# Altium project RS2-708_V010.PrjPCB (part 4 of 6)
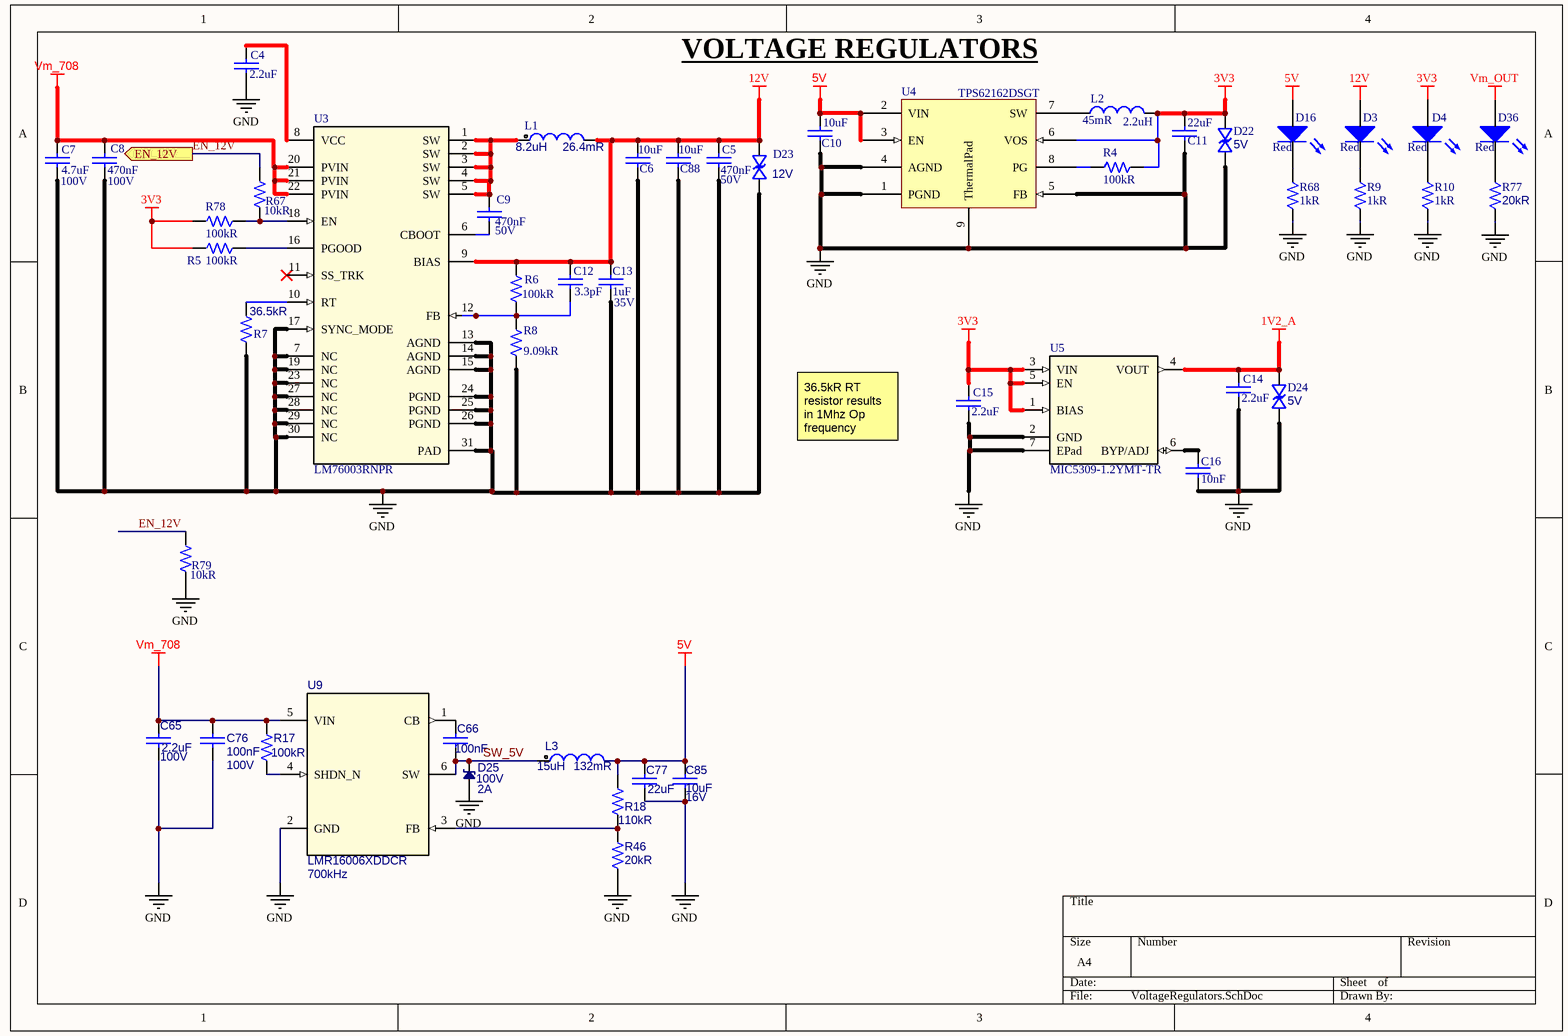
[diagram p10: VoltageRegulators.SchDoc]

## Sheet VoltageRegulators.SchDoc (continued)
### Library data of the parts
C4 C14 C15 = Capacitor: Manufacturer 1: Murata; Manufacturer Part Number 1: GRM155R61A225KE95D; Material: Ceramic; Dielectric: X5R; Voltage Rating (DC): 10V; Manufacturer: *; Manufacturer Part Number: *; Supplier: *; Supplier Part Number: *; Tolerance: *; Voltage: *; Footprint: *; Temperature Coefficient: *; Supplier 1: Digi-Key; Supplier Part Number 1: 490-10451-1-ND; Stock 1: 815357; Pricing 1: 1=0,11000, 10=0,08100, 100=0,03800, 500=0,02664, 1000=0,02205, 2500=0,02052, 5000=0,01878 (USD); RoHS: Yes; Mount: Surface Mount; Case/Package: 0402; Weight: 0.000212oz; Case Code (Metric): 1005; Case Code (Imperial): 0402; Min Operating Temperature: -55°C; Max Operating Temperature: 85°C; Termination: SMD/SMT; Package Quantity: 10000; Voltage Rating: 10V; Packaging: Tape and Reel; Length: 1mm; Height: 0.5mm; Thickness: 0.022inch; Depth: 0.5mm; Width: 0.5mm; REACH SVHC: No SVHC; Lead Free: Lead Free; ComponentLink1URL: http://www.mouser.com/ds/2/281/c02e-2905.pdf?src-supplier=Mouser; ComponentLink1Description: http://www.mouser.com/ds/2/281/c02e-2905.pdf?src-supplier=Mouser; ComponentLink2URL: http://components.arrow.com/part/dataview/0323_04264073?src-supplier=Arrow+Europe; ComponentLink2Description: http://components.arrow.com/part/dataview/0323_04264073?src-supplier=Arrow+Europe; ComponentLink3URL: http://www.farnell.com/datasheets/1872202.pdf?src-supplier=Farnell; ComponentLink3Description: http://www.farnell.com/datasheets/1872202.pdf?src-supplier=Farnell; ComponentLink4URL: http://www.farnell.com/datasheets/2047915.pdf?src-supplier=Farnell; ComponentLink4Description: http://www.farnell.com/datasheets/2047915.pdf?src-supplier=Farnell; ComponentLink5URL: http://www.farnell.com/datasheets/1872202.pdf?src-supplier=Element14; ComponentLink5Description: http://www.farnell.com/datasheets/1872202.pdf?src-supplier=Element14; ComponentLink6URL: https://search.murata.co.jp/Ceramy/image/img/A01X/G101/ENG/GRM155R61A225KE95-01.pdf?src-supplier=Digi-Key; ComponentLink6Description: https://search.murata.co.jp/Ceramy/image/img/A01X/G101/ENG/GRM155R61A225KE95-01.pdf?src-supplier=Digi-Key; ComponentLink7URL: http://www.farnell.com/datasheets/1872202.pdf?src-supplier=Newark; ComponentLink7Description: http://www.farnell.com/datasheets/1872202.pdf?src-supplier=Newark; ComponentLink8URL: http://psearch.en.murata.com/capacitor/product/GRM155R61A225KE95%23.pdf?src-supplier=Avnet; ComponentLink8Description: http://psearch.en.murata.com/capacitor/product/GRM155R61A225KE95%23.pdf?src-supplier=Avnet; ComponentLink9URL: http://www.farnell.com/datasheets/2047915.pdf?src-supplier=Element14; ComponentLink9Description: http://www.farnell.com/datasheets/2047915.pdf?src-supplier=Element14; ComponentLink10URL: http://www.farnell.com/datasheets/2047915.pdf?src-supplier=Newark; ComponentLink10Description: http://www.farnell.com/datasheets/2047915.pdf?src-supplier=Newark
C5 C9 = Capacitor: Manufacturer 1: TDK; Manufacturer Part Number 1: C1608X7R1H474K080AC; Dielectric Material: Ceramic; Dielectric: X7R; Manufacturer: *; Manufacturer Part Number: *; Supplier: *; Supplier Part Number: *; Tolerance: *; Voltage: *; Footprint: *; Temperature Coefficient: *; Supplier 1: Digi-Key; Supplier Part Number 1: 445-5952-1-ND; Stock 1: 221204; Pricing 1: 1=0,28000, 10=0,19000, 100=0,10750, 500=0,07590, 1000=0,06641 (USD); RoHS: Yes; Mount: Surface Mount; Case/Package: 0603; Weight: 7.1E-05oz; Case Code (Metric): 1608; Case Code (Imperial): 0603; Min Operating Temperature: -55°C; Max Operating Temperature: 125°C; Packaging: Tape and Reel; Package Quantity: 4000; Voltage Rating (DC): 50V; Termination: SMD/SMT; Composition: Ceramic; Length: 1.6mm; Height: 0.8mm; Thickness: 0.037inch; Depth: 0.8mm; Width: 0.031inch; Radiation Hardening: No; REACH SVHC: No SVHC; Lead Free: Lead Free; ComponentLink1URL: https://datasheet.ciiva.com/28693/1735394-28693461.pdf?src-supplier=Element14; ComponentLink1Description: https://datasheet.ciiva.com/28693/1735394-28693461.pdf?src-supplier=Element14; ComponentLink2URL: https://datasheet.ciiva.com/6290/tdkmlcccaprange-6290870.pdf?src-supplier=Digi-Key; ComponentLink2Description: https://datasheet.ciiva.com/6290/tdkmlcccaprange-6290870.pdf?src-supplier=Digi-Key; ComponentLink3URL: https://datasheet.ciiva.com/22718/1904212-22718022.pdf?src-supplier=Element14; ComponentLink3Description: https://datasheet.ciiva.com/22718/1904212-22718022.pdf?src-supplier=Element14; ComponentLink4URL: https://datasheet.ciiva.com/28451/1904212-28451367.pdf?src-supplier=Element14; ComponentLink4Description: https://datasheet.ciiva.com/28451/1904212-28451367.pdf?src-supplier=Element14; ComponentLink5URL: https://datasheet.ciiva.com/6290/tdkmlcccaprange-6290878.pdf?src-supplier=Digi-Key; ComponentLink5Description: https://datasheet.ciiva.com/6290/tdkmlcccaprange-6290878.pdf?src-supplier=Digi-Key; ComponentLink6URL: https://datasheet.ciiva.com/6290/tdkmlcccaprange-6290874.pdf?src-supplier=Digi-Key; ComponentLink6Description: https://datasheet.ciiva.com/6290/tdkmlcccaprange-6290874.pdf?src-supplier=Digi-Key; ComponentLink7URL: https://datasheet.ciiva.com/17487/e412-c-17487386.pdf?src-supplier=Avnet+Europe; ComponentLink7Description: https://datasheet.ciiva.com/17487/e412-c-17487386.pdf?src-supplier=Avnet+Europe; ComponentLink8URL: https://datasheet.ciiva.com/16427/e412-c-16427759.pdf?src-supplier=Future+Electronics; ComponentLink8Description: https://datasheet.ciiva.com/16427/e412-c-16427759.pdf?src-supplier=Future+Electronics
C6 C10 C88 = Capacitor: Manufacturer: Murata; Manufacturer Part Number: GRM188R61E106MA73J; Voltage Rating: 25V; Tolerance: 20%; Dielectric: X5R; Supplier 1: Digi-Key; Supplier Part Number 1: 490-12737-1-ND; Stock 1: 57764; Mount: Surface Mount; Case/Package: 0603; Weight: 0.000222oz; Case Code (Metric): 1608; Case Code (Imperial): 0603; Min Operating Temperature: -55°C; Max Operating Temperature: 85°C; Packaging: Tape and Reel; Capacitance: 10uF; Termination: SMD/SMT; Composition: Ceramic; Voltage Rating (DC): 25V; Package Quantity: 10000; Length: 0.063inch; Height: 0.8mm; Width: 0.031inch; Thickness: 0.039inch; Component Type: Capacitor Ceramic
C7 = Capacitor: Manufacturer 1: TDK; Manufacturer Part Number 1: CGA6M3X7S2A475K200AB; Tolerance: 10%; Dielectric: X7S; Supplier 1: Digi-Key; Supplier Part Number 1: 445-7005-1-ND; Stock 1: 314039; Pricing 1: 1=1,38000, 10=1,08700, 100=0,81510, 500=0,61582 (USD); RoHS: Yes; Mount: Surface Mount; Case/Package: 1210; Weight: 0.000564oz; Case Code (Metric): 3225; Case Code (Imperial): 1210; Min Operating Temperature: -55°C; Max Operating Temperature: 125°C; Package Quantity: 1; Packaging: Tape and Reel; Voltage Rating (DC): 100V; Termination: SMD/SMT; Composition: Ceramic; Length: 3.2mm; Height: 2mm; Width: 0.098inch; Thickness: 0.087inch; Depth: 2.5mm; Ratings: AEC-Q200; Radiation Hardening: No; Lead Free: Lead Free; REACH SVHC: No SVHC; ComponentLink1URL: https://datasheet.ciiva.com/24216/cga6m3x7s2a475k200ab-266278-24216372.pdf?src-supplier=Mouser; ComponentLink1Description: https://datasheet.ciiva.com/24216/cga6m3x7s2a475k200ab-266278-24216372.pdf?src-supplier=Mouser; ComponentLink2URL: https://datasheet.ciiva.com/26834/getdatasheetpartid-745136-26834554.pdf?src-supplier=Verical; ComponentLink2Description: https://datasheet.ciiva.com/26834/getdatasheetpartid-745136-26834554.pdf?src-supplier=Verical; ComponentLink3URL: https://datasheet.ciiva.com/8079/1807242-8079367.pdf?src-supplier=Element14; ComponentLink3Description: https://datasheet.ciiva.com/8079/1807242-8079367.pdf?src-supplier=Element14; ComponentLink4URL: https://datasheet.ciiva.com/28620/1735406-28620711.pdf?src-supplier=Element14; ComponentLink4Description: https://datasheet.ciiva.com/28620/1735406-28620711.pdf?src-supplier=Element14; ComponentLink5URL: https://datasheet.ciiva.com/22725/1735406-22725662.pdf?src-supplier=Element14; ComponentLink5Description: https://datasheet.ciiva.com/22725/1735406-22725662.pdf?src-supplier=Element14
C8 = Capacitor: Manufacturer 1: Murata; Manufacturer Part Number 1: GRM21BR72A474KA73L; Material: Ceramic; Dielectric: X7R; Manufacturer: *; Manufacturer Part Number: *; Supplier: *; Supplier Part Number: *; Tolerance: *; Voltage: *; Footprint: *; Temperature Coefficient: *; Supplier 1: Digi-Key; Supplier Part Number 1: 490-3326-1-ND; Stock 1: 259019; Pricing 1: 1=0,73000, 10=0,51300, 100=0,33770, 500=0,25016, 1000=0,21264 (USD); RoHS: Yes; Mount: Surface Mount; Case/Package: 0805; Case Code (Imperial): 0805; Case Code (Metric): 2012; Min Operating Temperature: -55°C; Max Operating Temperature: 125°C; Voltage Rating (DC): 100V; Packaging: Tape and Reel; Package Quantity: 1; Termination: SMD/SMT; Length: 2mm; Height: 1.25mm; Width: 1.25mm; Thickness: 0.053inch; Depth: 1.25mm; Radiation Hardening: No; REACH SVHC: No SVHC; Lead Free: Lead Free; ComponentLink1URL: https://datasheet.ciiva.com/140/grm21br72a474ka73-140555.pdf?src-supplier=Digi-Key; ComponentLink1Description: https://datasheet.ciiva.com/140/grm21br72a474ka73-140555.pdf?src-supplier=Digi-Key; ComponentLink2URL: https://datasheet.ciiva.com/3777/247grm21br72a474ka7323-3777925.pdf?src-supplier=Arrow; ComponentLink2Description: https://datasheet.ciiva.com/3777/247grm21br72a474ka7323-3777925.pdf?src-supplier=Arrow; ComponentLink3URL: https://datasheet.ciiva.com/140/grm21br72a474ka73-140556.pdf?src-supplier=Digi-Key; ComponentLink3Description: https://datasheet.ciiva.com/140/grm21br72a474ka73-140556.pdf?src-supplier=Digi-Key; ComponentLink4URL: https://datasheet.ciiva.com/11621/product-11621821.pdf?src-supplier=Avnet; ComponentLink4Description: https://datasheet.ciiva.com/11621/product-11621821.pdf?src-supplier=Avnet; ComponentLink5URL: https://datasheet.ciiva.com/16440/product-16440636.pdf?src-supplier=Future+Electronics; ComponentLink5Description: https://datasheet.ciiva.com/16440/product-16440636.pdf?src-supplier=Future+Electronics
C11 = Capacitor: Manufacturer: Samsung; Manufacturer Part Number: CL10A226MO7JZNC; Tolerance: 20%; Voltage Rating: 16V; Supplier 1: Digi-Key; Supplier Part Number 1: 1276-7076-1-ND; Stock 1: 269638; Mount: Surface Mount; Case/Package: 0603; Case Code (Imperial): 0603; Case Code (Metric): 1608; Min Operating Temperature: -55°C; Max Operating Temperature: 85°C; Packaging: Tape and Reel; Capacitance: 22uF; Component Type: Capacitor Ceramic
C12 = Capacitor: Manufacturer 1: Murata; Manufacturer Part Number 1: GJM1555C1H3R3CB01D; Dielectric: C0G; Voltage Rating (DC): 50V; Manufacturer: *; Manufacturer Part Number: *; Supplier: *; Supplier Part Number: *; Tolerance: *; Voltage: *; Footprint: *; Temperature Coefficient: *; Supplier 1: Digi-Key; Supplier Part Number 1: 490-3095-1-ND; Stock 1: 305012; Pricing 1: 1=0,12000, 10=0,08200, 100=0,03850, 500=0,02700, 1000=0,02236, 2500=0,02081, 5000=0,01904 (USD); RoHS: Yes; Mount: Surface Mount; Case/Package: 0402; Case Code (Imperial): 0402; Case Code (Metric): 1005; Min Operating Temperature: -55°C; Max Operating Temperature: 125°C; Package Quantity: 1; Packaging: Tape and Reel; Voltage Rating: 50V; Termination: SMD/SMT; Length: 1mm; Height: 0.5mm; Width: 0.5mm; Thickness: 0.022inch; Depth: 0.5mm; Radiation Hardening: No; Lead Free: Lead Free; ComponentLink1URL: https://datasheet.ciiva.com/17453/product-17453499.pdf?src-supplier=Avnet+Europe; ComponentLink1Description: https://datasheet.ciiva.com/17453/product-17453499.pdf?src-supplier=Avnet+Europe; ComponentLink2URL: https://datasheet.ciiva.com/18183/getdatasheetpartid-137633-18183838.pdf?src-supplier=Verical; ComponentLink2Description: https://datasheet.ciiva.com/18183/getdatasheetpartid-137633-18183838.pdf?src-supplier=Verical; ComponentLink3URL: https://datasheet.ciiva.com/132/partnumbering-e-01-132447.pdf?src-supplier=Digi-Key; ComponentLink3Description: https://datasheet.ciiva.com/132/partnumbering-e-01-132447.pdf?src-supplier=Digi-Key; ComponentLink4URL: https://datasheet.ciiva.com/16218/l0005e-16218053.pdf?src-supplier=Future+Electronics; ComponentLink4Description: https://datasheet.ciiva.com/16218/l0005e-16218053.pdf?src-supplier=Future+Electronics; ComponentLink5URL: https://datasheet.ciiva.com/132/partnumbering-e-01-132445.pdf?src-supplier=Digi-Key; ComponentLink5Description: https://datasheet.ciiva.com/132/partnumbering-e-01-132445.pdf?src-supplier=Digi-Key; ComponentLink6URL: https://datasheet.ciiva.com/132/partnumbering-e-01-132446.pdf?src-supplier=Digi-Key; ComponentLink6Description: https://datasheet.ciiva.com/132/partnumbering-e-01-132446.pdf?src-supplier=Digi-Key
C13 = Capacitor: Manufacturer 1: Murata; Manufacturer Part Number 1: GRM155R6YA105KE11D; Manufacturer: *; Manufacturer Part Number: *; Supplier: *; Supplier Part Number: *; Tolerance: *; Voltage: *; Footprint: *; Temperature Coefficient: *; Supplier 1: Digi-Key; Supplier Part Number 1: 490-10019-1-ND; Stock 1: 441965; Pricing 1: 1=0,26000, 10=0,18100, 100=0,10280, 500=0,07258, 1000=0,06350, 2500=0,06048, 5000=0,05594 (USD); RoHS: Yes; Mount: Surface Mount; Case/Package: 0402; Case Code (Imperial): 0402; Case Code (Metric): 1005; Min Operating Temperature: -55°C; Max Operating Temperature: 85°C; Packaging: Tape and Reel; Voltage Rating (DC): 35V; Length: 0.039inch; Width: 0.02inch; Thickness: 0.024inch; ComponentLink1URL: http://search.murata.co.jp/Ceramy/image/img/A01X/G101/ENG/GRM155R6YA105KE11-01.pdf?src-supplier=Digi-Key; ComponentLink1Description: http://search.murata.co.jp/Ceramy/image/img/A01X/G101/ENG/GRM155R6YA105KE11-01.pdf?src-supplier=Digi-Key; ComponentLink2URL: http://psearch.en.murata.com/capacitor/product/GRM155R6YA105KE11%23.pdf?src-supplier=Avnet; ComponentLink2Description: http://psearch.en.murata.com/capacitor/product/GRM155R6YA105KE11%23.pdf?src-supplier=Avnet
C16 = Capacitor: Manufacturer 1: Murata; Manufacturer Part Number 1: GCM155R71H103KA55D; Voltage Rating: 50V; Dielectric: X7R; Manufacturer: *; Manufacturer Part Number: *; Supplier: *; Supplier Part Number: *; Tolerance: *; Voltage: *; Footprint: *; Temperature Coefficient: *; Supplier 1: Digi-Key; Supplier Part Number 1: 490-4762-1-ND; Stock 1: 20325180; Pricing 1: 1=0,10000, 10=0,04400, 100=0,01980, 500=0,01412, 1000=0,01109, 2500=0,01008, 5000=0,00927 (USD); RoHS: Yes; Mount: Surface Mount; Case/Package: 0402; Case Code (Imperial): 0402; Case Code (Metric): 1005; Min Operating Temperature: -55°C; Max Operating Temperature: 125°C; Packaging: Tape and Reel; Package Quantity: 1; Termination: SMD/SMT; Voltage Rating (DC): 50V; Length: 1mm; Height: 0.5mm; Width: 0.02inch; Thickness: 0.022inch; Depth: 0.5mm; Ratings: AEC-Q200; Radiation Hardening: No; REACH SVHC: No SVHC; Lead Free: Lead Free; ComponentLink1URL: https://datasheet.ciiva.com/16199/product-16199584.pdf?src-supplier=Future+Electronics; ComponentLink1Description: https://datasheet.ciiva.com/16199/product-16199584.pdf?src-supplier=Future+Electronics; ComponentLink2URL: https://datasheet.ciiva.com/18100/getdatasheetpartid-27433-18100656.pdf?src-supplier=Verical; ComponentLink2Description: https://datasheet.ciiva.com/18100/getdatasheetpartid-27433-18100656.pdf?src-supplier=Verical; ComponentLink3URL: https://datasheet.ciiva.com/11787/0900766b80ef92d0-11787082.pdf?src-supplier=RSComponents; ComponentLink3Description: https://datasheet.ciiva.com/11787/0900766b80ef92d0-11787082.pdf?src-supplier=RSComponents; ComponentLink4URL: https://datasheet.ciiva.com/130/product-130683.pdf?src-supplier=Digi-Key; ComponentLink4Description: https://datasheet.ciiva.com/130/product-130683.pdf?src-supplier=Digi-Key; ComponentLink5URL: https://datasheet.ciiva.com/130/product-130682.pdf?src-supplier=Digi-Key; ComponentLink5Description: https://datasheet.ciiva.com/130/product-130682.pdf?src-supplier=Digi-Key; ComponentLink6URL: https://datasheet.ciiva.com/130/product-130684.pdf?src-supplier=Digi-Key; ComponentLink6Description: https://datasheet.ciiva.com/130/product-130684.pdf?src-supplier=Digi-Key; ComponentLink7URL: https://datasheet.ciiva.com/2989/product-2989235.pdf?src-supplier=Avnet; ComponentLink7Description: https://datasheet.ciiva.com/2989/product-2989235.pdf?src-supplier=Avnet; ComponentLink8URL: https://datasheet.ciiva.com/16624/product-16624550.pdf?src-supplier=Avnet+Europe; ComponentLink8Description: https://datasheet.ciiva.com/16624/product-16624550.pdf?src-supplier=Avnet+Europe
C65 = Capacitor: CAP CER 2.2UF 100V X7R 1206; Manufacturer 1: Yageo; Manufacturer Part Number 1: CC1206KKX7R0BB225; Manufacturer: *; Manufacturer Part Number: *; Supplier: *; Supplier Part Number: *; Tolerance: *; Voltage: *; Footprint: *; Temperature Coefficient: *; Supplier 1: Digi-Key; Supplier Part Number 1: 311-3450-1-ND; RoHS: Yes; Category: Ceramic Capacitors; Stock 1: 8; Pricing 1: 1=0,72000, 10=0,50600, 50=0,38280, 100=0,33330, 500=0,24690, 1000=0,20987 (USD); Mount: Surface Mount; Case/Package: 1206; Min Operating Temperature: -55°C; Max Operating Temperature: 125°C; Packaging: Tape and Reel; Length: 0.126inch; Width: 0.063inch; Thickness: 0.057inch; ComponentLink1URL: http://www.yageo.com/documents/recent/UPY-NP0X7R_MV_100-to-630V_21.pdf?src-supplier=Digi-Key; ComponentLink1Description: http://www.yageo.com/documents/recent/UPY-NP0X7R_MV_100-to-630V_21.pdf?src-supplier=Digi-Key; ComponentLink2URL: http://www.yageo.com/documents/recent/UPY-NP0X7R_MV_100-to-630V_18.pdf?src-supplier=Digi-Key; ComponentLink2Description: http://www.yageo.com/documents/recent/UPY-NP0X7R_MV_100-to-630V_18.pdf?src-supplier=Digi-Key
C66 = Capacitor: Manufacturer: TDK; Manufacturer Part Number: CGA2B3X7R1H104K050BB; Voltage Rating: 50V; Tolerance: 10%; Dielectric: X7R; Supplier 1: Digi-Key; Supplier Part Number 1: 445-6899-1-ND; Stock 1: 14098587; Mount: Surface Mount; Case/Package: 0402; Weight: 2.3E-05oz; Case Code (Metric): 1005; Case Code (Imperial): 0402; Min Operating Temperature: -55°C; Max Operating Temperature: 125°C; Packaging: Tape and Reel; Package Quantity: 1; Voltage Rating (DC): 50V; Termination: SMD/SMT; Composition: Ceramic; Voltage: 50V; Length: 1mm; Height: 0.5mm; Width: 0.02inch; Thickness: 0.022inch; Depth: 0.5mm; Ratings: AEC-Q200; REACH SVHC: No SVHC; Lead Free: Lead Free; ComponentLink1URL: http://product.tdk.com/capacitor/mlcc/en/documents/mlccspec_automotive_general_midvoltage_en.pdf?src-supplier=Future+Electronics; ComponentLink1Description: http://product.tdk.com/capacitor/mlcc/en/documents/mlccspec_automotive_general_midvoltage_en.pdf?src-supplier=Future+Electronics; ComponentLink2URL: http://www.farnell.com/datasheets/1807242.pdf?src-supplier=Element14; ComponentLink2Description: http://www.farnell.com/datasheets/1807242.pdf?src-supplier=Element14; ComponentLink3URL: http://www.mouser.com/ds/2/400/lcc_automotive_general_en-843974.pdf?src-supplier=Mouser; ComponentLink3Description: http://www.mouser.com/ds/2/400/lcc_automotive_general_en-843974.pdf?src-supplier=Mouser; ComponentLink4URL: http://www.farnell.com/datasheets/1936565.pdf?src-supplier=Element14; ComponentLink4Description: http://www.farnell.com/datasheets/1936565.pdf?src-supplier=Element14; ComponentLink5URL: http://www.farnell.com/datasheets/1735392.pdf?src-supplier=Element14; ComponentLink5Description: http://www.farnell.com/datasheets/1735392.pdf?src-supplier=Element14
C76 = Capacitor: 0402 0.1 uF 100 V ±10% Tolerance X5R SMT Multilayer Ceramic Capacitor; Manufacturer 1: Murata; Manufacturer Part Number 1: GRM155R62A104KE14D; Manufacturer: *; Manufacturer Part Number: *; Supplier: *; Supplier Part Number: *; Tolerance: *; Voltage: *; Footprint: *; Temperature Coefficient: *; Supplier 1: Digi-Key; Supplier Part Number 1: 490-10458-1-ND; RoHS: Yes; Category: Ceramic Capacitors; Stock 1: 1971097; Pricing 1: 1=0,10000, 10=0,02900, 50=0,01580, 100=0,01300, 500=0,00926, 1000=0,00727, 2500=0,00661, 5000=0,00608 (USD); Mount: Surface Mount; Case/Package: 0402; Case Code (Metric): 1005; Case Code (Imperial): 0402; Weight: 0.000212oz; Min Operating Temperature: -55°C; Max Operating Temperature: 85°C; Packaging: Tape and Reel; Dielectric: X5R; Termination: SMD/SMT; Voltage Rating (DC): 100V; Package Quantity: 10000; Length: 0.039inch; Width: 0.5mm; Height: 0.5mm; Thickness: 0.022inch; REACH SVHC: No SVHC; Lead Free: Lead Free; RoHS Compliant: Yes; ComponentLink1URL: http://www.farnell.com/datasheets/2079151.pdf?src-supplier=Farnell; ComponentLink1Description: http://www.farnell.com/datasheets/2079151.pdf?src-supplier=Farnell; ComponentLink2URL: http://www.mouser.com/ds/2/281/c02e-2905.pdf?src-supplier=Mouser; ComponentLink2Description: http://www.mouser.com/ds/2/281/c02e-2905.pdf?src-supplier=Mouser; ComponentLink3URL: http://search.murata.co.jp/Ceramy/image/img/A01X/G101/ENG/GRM155R62A104KE14-01.pdf?src-supplier=Digi-Key; ComponentLink3Description: http://search.murata.co.jp/Ceramy/image/img/A01X/G101/ENG/GRM155R62A104KE14-01.pdf?src-supplier=Digi-Key; ComponentLink4URL: http://www.farnell.com/datasheets/2079151.pdf?src-supplier=Newark; ComponentLink4Description: http://www.farnell.com/datasheets/2079151.pdf?src-supplier=Newark; ComponentLink5URL: http://www.farnell.com/datasheets/2079151.pdf?src-supplier=Element14; ComponentLink5Description: http://www.farnell.com/datasheets/2079151.pdf?src-supplier=Element14
C77 = Capacitor: CAP CER 22UF 16V X5R 0805; Manufacturer 1: Samsung; Manufacturer Part Number 1: CL21A226KOQNNNE; Manufacturer: *; Manufacturer Part Number: *; Supplier: *; Supplier Part Number: *; Tolerance: *; Voltage: *; Footprint: *; Temperature Coefficient: *; Supplier 1: Digi-Key; Supplier Part Number 1: 1276-6526-1-ND; RoHS: Yes; Category: Ceramic Capacitors; Stock 1: 430260; Pricing 1: 1=0,37000, 10=0,25800, 50=0,18040, 100=0,15460, 500=0,11592, 1000=0,09789 (USD); Mount: Surface Mount; Case/Package: 0805; Case Code (Metric): 2012; Case Code (Imperial): 0805; Min Operating Temperature: -55°C; Max Operating Temperature: 85°C; Packaging: Tape and Reel; Voltage Rating: 16V; Voltage Rating (DC): 16V; Length: 0.079inch; Width: 0.049inch; Thickness: 0.055inch; Lead Free: Lead Free; RoHS Compliant: Yes; ComponentLink1URL: http://www.samsungsem.com/kr/support/library/product-catalog/mlcc.jsp?src-supplier=Digi-Key; ComponentLink1Description: http://www.samsungsem.com/kr/support/library/product-catalog/mlcc.jsp?src-supplier=Digi-Key
C85 = Capacitor: TDK - C1608X5R1C106M080AB - SMD Multilayer Ceramic Capacitor, 10 µF, 16 V, 0603 [1608 Metric], ± 20%, X5R, C Series; Manufacturer: *; Manufacturer Part Number: *; Supplier: *; Supplier Part Number: *; Tolerance: *; Voltage: *; Footprint: *; Temperature Coefficient: *; Supplier 1: Digi-Key; Supplier Part Number 1: 445-9065-1-ND; Manufacturer 1: TDK; Manufacturer Part Number 1: C1608X5R1C106M080AB; RoHS: Yes; Category: Ceramic Capacitors; Stock 1: 251861; Pricing 1: 1=0,68000, 10=0,48400, 50=0,36580, 100=0,31860, 500=0,23598, 1000=0,20058 (USD); Mount: Surface Mount; Case/Package: 0603; Case Code (Metric): 1608; Case Code (Imperial): 0603; Weight: 7.1E-05oz; Dielectric Material: Ceramic; Min Operating Temperature: -55°C; Max Operating Temperature: 85°C; Package Quantity: 4000; Voltage Rating: 16V; Packaging: Tape and Reel; Dielectric: X5R; Termination: SMD/SMT; Resistor Type: Ceramic; Series: C; Length: 1.6mm; Width: 0.031inch; Height: 0.8mm; Thickness: 0.039inch; Depth: 0.8mm; Radiation Hardening: No; REACH SVHC: No SVHC; Lead Free: Lead Free; RoHS Compliant: Yes; ComponentLink1URL: https://datasheet.ciiva.com/26946/getdatasheetpartid-727879-26946512.pdf?src-supplier=Verical; ComponentLink1Description: https://datasheet.ciiva.com/26946/getdatasheetpartid-727879-26946512.pdf?src-supplier=Verical; ComponentLink2URL: https://datasheet.ciiva.com/24216/mlcc-commercial-general-en-24216005.pdf?src-supplier=Mouser; ComponentLink2Description: https://datasheet.ciiva.com/24216/mlcc-commercial-general-en-24216005.pdf?src-supplier=Mouser; ComponentLink3URL: https://datasheet.ciiva.com/16449/mlcc-commercial-general-en-16449581.pdf?src-supplier=Future+Electronics; ComponentLink3Description: https://datasheet.ciiva.com/16449/mlcc-commercial-general-en-16449581.pdf?src-supplier=Future+Electronics
D3 D4 D16 D36 = LED: Manufacturer: Wurth Electronics Inc.; Manufacturer Part Number: 150060RS75000; Component Type: Red 625nm LED Indication - Discrete 2V 0603 (1608 Metric); Price: 0.39; Supplier: Digi-Key; Supplier Part Number: 732-4978-1-ND
D22 D24 = TVS-Bidirectional: TVS DIODE 5V 20V SLP1006P2T; Manufacturer 1: Semtech; Manufacturer Part Number 1: RCLAMP0531TQTCT; Peak Pulse Current: 4A; Element Configuration: Single; Number of Bidirectional Channels: 1; Min Breakdown Voltage: 6V; Peak Pulse Power: 80W; Power Line Protection: No; Leakage Current: 100nA; Supplier 1: Digi-Key; Supplier Part Number 1: RCLAMP0531TQTCTCT-ND; RoHS: Yes; Category: TVS Diodes; Stock 1: 9000; Pricing 1: 1=1,09000, 10=0,97400, 100=0,69300, 500=0,58740, 1000=0,47850 (USD); Mount: Surface Mount; Case/Package: 0402; Number of Pins: 2; Case Code (Imperial): 0402; Case Code (Metric): 1006; Min Operating Temperature: -40°C; Max Operating Temperature: 125°C; Direction: Bidirectional; Packaging: Tape and Reel; Package Quantity: 3000; Resistor Type: Zener; Clamping Voltage: 20V; Working Voltage: 5V; Length: 1mm; Depth: 0.6mm; Radiation Hardening: No; Lead Free: Lead Free; ComponentLink1URL: https://datasheet.ciiva.com/26946/getdatasheetpartid-791156-26946873.pdf?src-supplier=Verical; ComponentLink1Description: https://datasheet.ciiva.com/26946/getdatasheetpartid-791156-26946873.pdf?src-supplier=Verical; ComponentLink2URL: https://datasheet.ciiva.com/29574/rclamp0531tq-29574060.pdf?src-supplier=Digi-Key; ComponentLink2Description: https://datasheet.ciiva.com/29574/rclamp0531tq-29574060.pdf?src-supplier=Digi-Key
D23 = TVS-Bidirectional: TVS DIODE 12V 27V SLP1006P2T; Manufacturer 1: Semtech; Manufacturer Part Number 1: UCLAMP1211T.TCT; Element Configuration: Single; Peak Pulse Current: 1A; Number of Bidirectional Channels: 1; Min Breakdown Voltage: 13.3V; Power Line Protection: No; Leakage Current: 50nA; Supplier 1: Digi-Key; Supplier Part Number 1: UCLAMP1211T.TCTCT-ND; RoHS: Yes; Category: TVS Diodes; Stock 1: 75056; Pricing 1: 1=0,68000, 10=0,59400, 100=0,40500, 500=0,33840, 1000=0,28800 (USD); Mount: Surface Mount; Case/Package: 0402; Number of Pins: 2; Case Code (Imperial): 0402; Case Code (Metric): 1006; Min Operating Temperature: -55°C; Max Operating Temperature: 125°C; Direction: Bidirectional; Clamping Voltage: 27V; Package Quantity: 3000; Packaging: Tape and Reel; Resistor Type: Zener; Reverse Standoff Voltage: 12V; Length: 1mm; Depth: 0.6mm; Radiation Hardening: No; ComponentLink1URL: https://datasheet.ciiva.com/29587/uclamp1211t-29587782.pdf?src-supplier=Digi-Key; ComponentLink1Description: https://datasheet.ciiva.com/29587/uclamp1211t-29587782.pdf?src-supplier=Digi-Key; ComponentLink2URL: https://datasheet.ciiva.com/45262/uclamp1211t-45262805.pdf?src-supplier=Digi-Key; ComponentLink2Description: https://datasheet.ciiva.com/45262/uclamp1211t-45262805.pdf?src-supplier=Digi-Key; ComponentLink3URL: https://datasheet.ciiva.com/11195/uclamp1211t-11195113.pdf?src-supplier=Avnet; ComponentLink3Description: https://datasheet.ciiva.com/11195/uclamp1211t-11195113.pdf?src-supplier=Avnet
D25 = Diode_Shottky_2: DIODE SCHOTTKY 100V 2A SOD123F; Manufacturer 1: STMicroelectronics; Manufacturer Part Number 1: STPS2H100ZF; Supplier 1: Digi-Key; Supplier Part Number 1: 497-17152-1-ND; RoHS: Yes; Category: Rectifier Diodes; Stock 1: 49302; Pricing 1: 1=0,50000, 10=0,37000, 100=0,20930, 500=0,13860, 1000=0,10626 (USD); Mount: Surface Mount; Packaging: Cut Tape; RoHS Compliant: Yes; ComponentLink1URL: http://www.farnell.com/datasheets/2236221.pdf?src-supplier=Farnell; ComponentLink1Description: http://www.farnell.com/datasheets/2236221.pdf?src-supplier=Farnell; ComponentLink2URL: http://www.st.com/content/ccc/resource/technical/document/datasheet/group3/e0/1c/dc/bb/11/47/42/2a/DM00321023/files/DM00321023.pdf/jcr:content/translations/en.DM00321023.pdf?src-supplier=Digi-Key; ComponentLink2Description: http://www.st.com/content/ccc/resource/technical/document/datasheet/group3/e0/1c/dc/bb/11/47/42/2a/DM00321023/files/DM00321023.pdf/jcr:content/translations/en.DM00321023.pdf?src-supplier=Digi-Key
L1 = Inductor: COILCRAFT - XAL6060-822MEC - Power Inductor (SMD), 8.2 µH, 8 A, Shielded, 8.4 A, XAL6060 Series, 6.56mm x 6.36mm x 6.1mm; Core Material: Composite; Inductance Tolerance: 20%; Self Resonant Frequency: 16MHz; Max DC Current: 8A; Test Frequency: 100kHz; Saturation Current: 8.4A; Supplier 1: Mouser; Supplier Part Number 1: 994-XAL6060-822MEC; Manufacturer 1: Coilcraft; Manufacturer Part Number 1: XAL6060-822MEC; RoHS: Yes; Category: Fixed Inductors; Stock 1: 784; Pricing 1: 1=2,58000, 10=2,58000, 50=2,58000, 100=2,25000, 1000=1,18000, 10000=1,10000 (USD); Mount: Surface Mount; Case/Package: SMD/SMT; Min Operating Temperature: -40°C; Max Operating Temperature: 125°C; Packaging: Tape and Reel; Package Quantity: 250; Tolerance: 20%; Shielding: Shielded; Termination: SMD/SMT; RMS Current (Irms): 8A; Series: XAL6060; Length: 6.76mm; Width: 6.56mm; Height: 6.1mm; REACH SVHC: Unknown; Lead Free: Contains Lead; RoHS Compliant: Yes; ComponentLink1URL: https://datasheet.ciiva.com/13277/xal60xx-270658-13277238.pdf?src-supplier=Mouser; ComponentLink1Description: https://datasheet.ciiva.com/13277/xal60xx-270658-13277238.pdf?src-supplier=Mouser
L2 = Inductor: Manufacturer 1: Vishay Dale; Manufacturer Part Number 1: IFSC1515AHER2R2M01; Inductance Tolerance: 20%; Shielding: Shielded; Current Rating: 3A; Test Frequency: 100kHz; Supplier 1: Digi-Key; Supplier Part Number 1: 541-1404-1-ND; Stock 1: 79626; Pricing 1: 1=0,64000, 10=0,55900, 100=0,39960, 500=0,33568, 1000=0,27175 (USD); RoHS: Yes; Mount: Surface Mount; Case/Package: 1515; Number of Pins: 2; Contact Plating: Tin; Min Operating Temperature: -55°C; Max Operating Temperature: 125°C; Packaging: Tape and Reel; Tolerance: 20%; Package Quantity: 2000; Saturation Current: 3A; Max DC Current: 3A; Termination: SMD/SMT; RMS Current (Irms): 3A; Military Standard: Not; Length: 4mm; Height: 1.8mm; Width: 3.8mm; Height - Seated (Max): 0.075inch; Depth: 4mm; REACH SVHC: Unknown; Lead Free: Lead Free; ComponentLink1URL: https://datasheet.ciiva.com/8017/sc15ah01-8017541.pdf?src-supplier=Element14; ComponentLink1Description: https://datasheet.ciiva.com/8017/sc15ah01-8017541.pdf?src-supplier=Element14; ComponentLink2URL: https://datasheet.ciiva.com/8495/sc15ah01-8495050.pdf?src-supplier=Avnet; ComponentLink2Description: https://datasheet.ciiva.com/8495/sc15ah01-8495050.pdf?src-supplier=Avnet; ComponentLink3URL: https://datasheet.ciiva.com/6702/sc15ah01-6702123.pdf?src-supplier=Digi-Key; ComponentLink3Description: https://datasheet.ciiva.com/6702/sc15ah01-6702123.pdf?src-supplier=Digi-Key; ComponentLink4URL: https://datasheet.ciiva.com/6702/sc15ah01-6702124.pdf?src-supplier=Digi-Key; ComponentLink4Description: https://datasheet.ciiva.com/6702/sc15ah01-6702124.pdf?src-supplier=Digi-Key; ComponentLink5URL: https://datasheet.ciiva.com/46395/1913058-46395301.pdf?src-supplier=Element14; ComponentLink5Description: https://datasheet.ciiva.com/46395/1913058-46395301.pdf?src-supplier=Element14; ComponentLink6URL: https://datasheet.ciiva.com/22726/1730404-22726056.pdf?src-supplier=Element14; ComponentLink6Description: https://datasheet.ciiva.com/22726/1730404-22726056.pdf?src-supplier=Element14; ComponentLink7URL: https://datasheet.ciiva.com/6702/sc15ah01-6702125.pdf?src-supplier=Digi-Key; ComponentLink7Description: https://datasheet.ciiva.com/6702/sc15ah01-6702125.pdf?src-supplier=Digi-Key
L3 = Inductor: FIXED IND 15UH 1.45A 132 MOHM; Manufacturer 1: Wurth Electronics; Manufacturer Part Number 1: 74404043150A; Core Material: Ferrite; Tolerance: 20%; Saturation Current: 840mA; Shielding: Shielded; Self Resonant Frequency: 33MHz; Test Frequency: 100kHz; Supplier 1: Digi-Key; Supplier Part Number 1: 732-10760-1-ND; RoHS: Yes; Category: Fixed Inductors; Stock 1: 10986; Pricing 1: 1=0,60000, 50=0,49580, 100=0,37690, 1000=0,32728 (USD); Mount: Surface Mount; Case/Package: Nonstandard; Min Operating Temperature: -40°C; Max Operating Temperature: 125°C; Resistor Type: Wirewound; Packaging: Cut Tape; Current Rating: 1.45A; RoHS Compliant: Yes; ComponentLink1URL: http://www.farnell.com/datasheets/2277224.pdf?src-supplier=Farnell; ComponentLink1Description: http://www.farnell.com/datasheets/2277224.pdf?src-supplier=Farnell; ComponentLink2URL: https://katalog.we-online.de/pbs/datasheet/74404043150A.pdf?src-supplier=Digi-Key; ComponentLink2Description: https://katalog.we-online.de/pbs/datasheet/74404043150A.pdf?src-supplier=Digi-Key
R4-R6 R17 R78 = Resistor: Manufacturer 1: Yageo; Manufacturer Part Number 1: RC0402FR-07100KL; Tolerance: 1%; Temperature Coefficient: 100ppm/°C; Power Rating: 63mW; Voltage Rating: 50V; Supplier 1: Digi-Key; Supplier Part Number 1: 311-100KLRDKR-ND; Stock 1: 20416104; Pricing 1: 1=0,10000, 10=0,01600, 100=0,00640, 1000=0,00289, 2500=0,00251, 5000=0,00207 (USD); RoHS: Yes; Case/Package: 0402; Case Code (Metric): 1005; Case Code (Imperial): 0402; Min Operating Temperature: -55°C; Max Operating Temperature: 155°C; Composition: Thick Film; Packaging: Tape and Reel; Package Quantity: 1; Max Power Dissipation: 63mW; Working Voltage: 50V; Features: Moisture Resistant; Number of Terminations: 2; Termination: SMD/SMT; Military Standard: Not; Length: 0.039inch; Height: 0.016inch; Width: 0.02inch; Depth: 0.5mm; Lead Free: Lead Free; REACH SVHC: No SVHC; ComponentLink1URL: https://datasheet.ciiva.com/11819/0900766b80c66297-11819452.pdf?src-supplier=RSComponents; ComponentLink1Description: https://datasheet.ciiva.com/11819/0900766b80c66297-11819452.pdf?src-supplier=RSComponents; ComponentLink2URL: https://datasheet.ciiva.com/2453/pyu-r-int-thick-7-2453361.pdf?src-supplier=Digi-Key; ComponentLink2Description: https://datasheet.ciiva.com/2453/pyu-r-int-thick-7-2453361.pdf?src-supplier=Digi-Key; ComponentLink3URL: https://datasheet.ciiva.com/2453/pyu-r-int-thick-7-2453362.pdf?src-supplier=Digi-Key; ComponentLink3Description: https://datasheet.ciiva.com/2453/pyu-r-int-thick-7-2453362.pdf?src-supplier=Digi-Key; ComponentLink4URL: https://datasheet.ciiva.com/2453/pyu-r-int-thick-7-2453363.pdf?src-supplier=Digi-Key; ComponentLink4Description: https://datasheet.ciiva.com/2453/pyu-r-int-thick-7-2453363.pdf?src-supplier=Digi-Key; ComponentLink5URL: https://datasheet.ciiva.com/22747/1018594-22747509.pdf?src-supplier=Element14; ComponentLink5Description: https://datasheet.ciiva.com/22747/1018594-22747509.pdf?src-supplier=Element14; ComponentLink6URL: https://datasheet.ciiva.com/15189/getdatasheetpartid-323696-15189334.pdf?src-supplier=Verical; ComponentLink6Description: https://datasheet.ciiva.com/15189/getdatasheetpartid-323696-15189334.pdf?src-supplier=Verical; ComponentLink7URL: https://datasheet.ciiva.com/12667/pyu-rc0402-51-rohs-l-6-r-12667930.pdf?src-supplier=Mouser; ComponentLink7Description: https://datasheet.ciiva.com/12667/pyu-rc0402-51-rohs-l-6-r-12667930.pdf?src-supplier=Mouser
R7 = Resistor: RES SMD 36.5KOHM 0.1% 1/16W 0402; Manufacturer 1: Panasonic; Manufacturer Part Number 1: ERA-2AEB3652X; Power Rating: 63mW; Voltage Rating: 25V; Temperature Coefficient: 25ppm/°C; Voltage Rating (DC): 50V; Supplier 1: Digi-Key; Supplier Part Number 1: P36.5KDCCT-ND; RoHS: Yes; Category: Chip SMD Resistors; Stock 1: 15486; Pricing 1: 1=0,39000, 10=0,27800, 100=0,11110, 1000=0,05474, 2500=0,05072, 5000=0,04588 (USD); Mount: Surface Mount; Case/Package: 0402; Case Code (Metric): 1005; Case Code (Imperial): 0402; Min Operating Temperature: -55°C; Max Operating Temperature: 155°C; Packaging: Tape and Reel; Tolerance: 0.1%; Package Quantity: 10000; Resistor Type: Thin Film,Metal Film; Number of Terminations: 2; Max Power Dissipation: 63mW; Length: 1mm; Width: 0.02inch; Height: 0.016inch; Depth: 0.5mm; REACH SVHC: Unknown; Lead Free: Lead Free; Military Standard: Not; ComponentLink1URL: https://media.digikey.com/pdf/Data%20Sheets/Panasonic%20Resistors%20Thermistors%20PDFs/ERA_Series_LE.pdf?src-supplier=Digi-Key; ComponentLink1Description: https://media.digikey.com/pdf/Data%20Sheets/Panasonic%20Resistors%20Thermistors%20PDFs/ERA_Series_LE.pdf?src-supplier=Digi-Key; ComponentLink2URL: http://www.mouser.com/ds/2/315/AOA0000C237-1100991.pdf?src-supplier=Mouser; ComponentLink2Description: http://www.mouser.com/ds/2/315/AOA0000C237-1100991.pdf?src-supplier=Mouser; ComponentLink3URL: http://components.arrow.com/part/dataview/0323_02916437?src-supplier=Arrow+Europe; ComponentLink3Description: http://components.arrow.com/part/dataview/0323_02916437?src-supplier=Arrow+Europe; ComponentLink4URL: https://industrial.panasonic.com/cdbs/www-data/pdf/RDM0000/AOA0000C307.pdf?src-supplier=Digi-Key; ComponentLink4Description: https://industrial.panasonic.com/cdbs/www-data/pdf/RDM0000/AOA0000C307.pdf?src-supplier=Digi-Key; ComponentLink5URL: http://industrial.panasonic.com/cdbs/www-data/pdf/RDM0000/AOA0000C307.pdf?src-supplier=Farnell; ComponentLink5Description: http://industrial.panasonic.com/cdbs/www-data/pdf/RDM0000/AOA0000C307.pdf?src-supplier=Farnell; ComponentLink6URL: http://www.onlinecomponents.com/datasheet/era-2aeb3652x.aspx?p=44473727&src-supplier=Onlinecomponents.com; ComponentLink6Description: http://www.onlinecomponents.com/datasheet/era-2aeb3652x.aspx?p=44473727&src-supplier=Onlinecomponents.com; ComponentLink7URL: http://www.farnell.com/datasheets/1818319.pdf?src-supplier=Element14; ComponentLink7Description: http://www.farnell.com/datasheets/1818319.pdf?src-supplier=Element14; ComponentLink8URL: http://www.farnell.com/datasheets/2052875.pdf?src-supplier=Newark; ComponentLink8Description: http://www.farnell.com/datasheets/2052875.pdf?src-supplier=Newark
R8 = Resistor: Manufacturer 1: Vishay; Manufacturer Part Number 1: CRCW04029K09FKED; Power Rating: 63mW; Tolerance: 1%; Voltage Rating: 50V; Temperature Coefficient: 100ppm/°C; Supplier 1: Digi-Key; Supplier Part Number 1: 541-9.09KLCT-ND; Stock 1: 23574; Pricing 1: 1=0,10000, 10=0,03600, 100=0,01460, 1000=0,00657, 2500=0,00570, 5000=0,00471 (USD); RoHS: Yes; Mount: Surface Mount; Case/Package: 0402; Number of Pins: 2; Weight: 2.3E-05oz; Case Code (Metric): 1005; Case Code (Imperial): 0402; Contact Plating: Tin; Min Operating Temperature: -55°C; Max Operating Temperature: 155°C; Packaging: Tape and Reel; Features: Automotive AEC-Q200; Package Quantity: 10; Voltage Rating (DC): 50V; Composition: Thick Film; Number of Terminations: 2; Termination: SMD/SMT; Military Standard: Not; Max Power Dissipation: 63mW; Length: 1mm; Height: 0.35mm; Width: 0.02inch; Depth: 0.5mm; Radiation Hardening: No; REACH SVHC: Unknown; Lead Free: Lead Free; ComponentLink1URL: https://datasheet.ciiva.com/11818/0900766b80d98824-11818154.pdf?src-supplier=RSComponents; ComponentLink1Description: https://datasheet.ciiva.com/11818/0900766b80d98824-11818154.pdf?src-supplier=RSComponents; ComponentLink2URL: https://datasheet.ciiva.com/16394/dcrcwe3-16394661.pdf?src-supplier=Future+Electronics; ComponentLink2Description: https://datasheet.ciiva.com/16394/dcrcwe3-16394661.pdf?src-supplier=Future+Electronics; ComponentLink3URL: https://datasheet.ciiva.com/3256/dcrcwe3-3256905.pdf?src-supplier=Avnet; ComponentLink3Description: https://datasheet.ciiva.com/3256/dcrcwe3-3256905.pdf?src-supplier=Avnet; ComponentLink4URL: https://datasheet.ciiva.com/5541/dcrcwe3-109170-5541359.pdf?src-supplier=Mouser; ComponentLink4Description: https://datasheet.ciiva.com/5541/dcrcwe3-109170-5541359.pdf?src-supplier=Mouser; ComponentLink5URL: https://datasheet.ciiva.com/2464/dcrcwe3-2464057.pdf?src-supplier=Digi-Key; ComponentLink5Description: https://datasheet.ciiva.com/2464/dcrcwe3-2464057.pdf?src-supplier=Digi-Key; ComponentLink6URL: https://datasheet.ciiva.com/2464/dcrcwe3-2464058.pdf?src-supplier=Digi-Key; ComponentLink6Description: https://datasheet.ciiva.com/2464/dcrcwe3-2464058.pdf?src-supplier=Digi-Key; ComponentLink7URL: https://datasheet.ciiva.com/2464/dcrcwe3-2464059.pdf?src-supplier=Digi-Key; ComponentLink7Description: https://datasheet.ciiva.com/2464/dcrcwe3-2464059.pdf?src-supplier=Digi-Key; ComponentLink8URL: https://datasheet.ciiva.com/16885/dcrcwe3-16885932.pdf?src-supplier=Avnet+Europe; ComponentLink8Description: https://datasheet.ciiva.com/16885/dcrcwe3-16885932.pdf?src-supplier=Avnet+Europe
R9 R10 R68 = Resistor: Manufacturer 1: Panasonic; Manufacturer Part Number 1: ERJ-2GEJ102X; Temperature Coefficient: 200ppm/°C; Voltage Rating (DC): 50V; Tolerance: 5%; Power Rating: 100mW; Supplier 1: Digi-Key; Supplier Part Number 1: P1.0KJCT-ND; Stock 1: 3554258; Pricing 1: 1=0,10000, 10=0,03200, 100=0,01290, 1000=0,00578, 2500=0,00502, 5000=0,00414 (USD); RoHS: Yes; Mount: Surface Mount; Case/Package: 0402; Case Code (Metric): 1005; Case Code (Imperial): 0402; Contact Plating: Tin; Min Operating Temperature: -55°C; Max Operating Temperature: 155°C; Composition: Thick Film; Number of Terminations: 2; Termination: SMD/SMT; Military Standard: Not; Packaging: Tape and Reel; Voltage Rating: 50V; Package Quantity: 1; Features: Automotive AEC-Q200; Max Power Dissipation: 100mW; Working Voltage: 50V; Length: 1mm; Height: 0.35mm; Depth: 0.5mm; Width: 0.02inch; Radiation Hardening: No; Lead Free: Lead Free; REACH SVHC: No SVHC; ComponentLink1URL: https://datasheet.ciiva.com/11821/0900766b80f806dd-11821202.pdf?src-supplier=RSComponents; ComponentLink1Description: https://datasheet.ciiva.com/11821/0900766b80f806dd-11821202.pdf?src-supplier=RSComponents; ComponentLink2URL: https://datasheet.ciiva.com/34303/1986781-34303542.pdf?src-supplier=Jameco; ComponentLink2Description: https://datasheet.ciiva.com/34303/1986781-34303542.pdf?src-supplier=Jameco; ComponentLink3URL: https://datasheet.ciiva.com/16762/70260739-16762170.pdf?src-supplier=Allied+Electronics; ComponentLink3Description: https://datasheet.ciiva.com/16762/70260739-16762170.pdf?src-supplier=Allied+Electronics; ComponentLink4URL: https://datasheet.ciiva.com/17215/aoa0000ce1-17215306.pdf?src-supplier=Avnet+Europe; ComponentLink4Description: https://datasheet.ciiva.com/17215/aoa0000ce1-17215306.pdf?src-supplier=Avnet+Europe; ComponentLink5URL: https://datasheet.ciiva.com/43460/1500035-43460379.pdf?src-supplier=Farnell; ComponentLink5Description: https://datasheet.ciiva.com/43460/1500035-43460379.pdf?src-supplier=Farnell; ComponentLink6URL: https://datasheet.ciiva.com/16199/aoa0000ce1-16199541.pdf?src-supplier=Future+Electronics; ComponentLink6Description: https://datasheet.ciiva.com/16199/aoa0000ce1-16199541.pdf?src-supplier=Future+Electronics; ComponentLink7URL: https://datasheet.ciiva.com/30219/4aoa0000ce1-30219159.pdf?src-supplier=Onlinecomponents.com; ComponentLink7Description: https://datasheet.ciiva.com/30219/4aoa0000ce1-30219159.pdf?src-supplier=Onlinecomponents.com; ComponentLink8URL: https://datasheet.ciiva.com/22783/1500035-22783817.pdf?src-supplier=Farnell; ComponentLink8Description: https://datasheet.ciiva.com/22783/1500035-22783817.pdf?src-supplier=Farnell; ComponentLink9URL: https://datasheet.ciiva.com/48531/aoa0000ce1-48531081.pdf?src-supplier=Avnet; ComponentLink9Description: https://datasheet.ciiva.com/48531/aoa0000ce1-48531081.pdf?src-supplier=Avnet; ComponentLink10URL: https://datasheet.ciiva.com/46386/1500035-46386458.pdf?src-supplier=Element14; ComponentLink10Description: https://datasheet.ciiva.com/46386/1500035-46386458.pdf?src-supplier=Element14; ComponentLink11URL: https://datasheet.ciiva.com/16511/aoa0000ce1-16511421.pdf?src-supplier=Avnet+Asia; ComponentLink11Description: https://datasheet.ciiva.com/16511/aoa0000ce1-16511421.pdf?src-supplier=Avnet+Asia; ComponentLink12URL: https://datasheet.ciiva.com/46371/1500035-46371935.pdf?src-supplier=Element14; ComponentLink12Description: https://datasheet.ciiva.com/46371/1500035-46371935.pdf?src-supplier=Element14
R18 = Resistor: Res Thick Film 0402 110K Ohm 1% 0.063W(1/16W) ±100ppm/C Pad SMD Automotive T/R; Manufacturer 1: Yageo; Manufacturer Part Number 1: AC0402FR-07110KL; Max Power Dissipation: 63mW; Temperature Coefficient: 100ppm/°C; Supplier 1: Digi-Key; Supplier Part Number 1: YAG5253CT-ND; RoHS: Yes; Category: Chip SMD Resistors; Stock 1: 34526; Pricing 1: 1=0,10000, 10=0,02200, 100=0,00900, 1000=0,00402, 2500=0,00349, 5000=0,00288 (USD); Case/Package: 0402; Min Operating Temperature: -55°C; Max Operating Temperature: 155°C; Packaging: Tape and Reel; Resistor Type: Thick Film; Number of Terminations: 2; Tolerance: 1%; Features: Moisture Resistant,Automotive AEC-Q200; Length: 0.039inch; Width: 0.02inch; Height: 0.015inch; RoHS Compliant: Yes; ComponentLink1URL: http://www.yageo.com/NewPortal/yageodocoutput?fileName=/pdf/R-Chip/PYu-AC_51_RoHS_L_6.pdf&src-supplier=Digi-Key; ComponentLink1Description: http://www.yageo.com/NewPortal/yageodocoutput?fileName=/pdf/R-Chip/PYu-AC_51_RoHS_L_6.pdf&src-supplier=Digi-Key; ComponentLink2URL: http://www.yageo.com/NewPortal/yageodocoutput?fileName=/pdf/R-Chip/PYu-AC_51_RoHS_L_5.pdf&src-supplier=Digi-Key; ComponentLink2Description: http://www.yageo.com/NewPortal/yageodocoutput?fileName=/pdf/R-Chip/PYu-AC_51_RoHS_L_5.pdf&src-supplier=Digi-Key
R46 = Resistor: YAGEO - RC0402FR-0720KL - RES, THICK FILM, 20K, 1%, 0.0625W, 0402; Power Rating: 62.5mW; Voltage Rating: 50V; Temperature Coefficient: 100ppm/°C; Max Power Dissipation: 63mW; Supplier 1: Digi-Key; Supplier Part Number 1: 311-20.0KLRCT-ND; Manufacturer 1: Yageo; Manufacturer Part Number 1: RC0402FR-0720KL; RoHS: Yes; Category: Chip SMD Resistors; Stock 1: 2029421; Pricing 1: 1=0,10000, 10=0,01600, 100=0,00660, 1000=0,00299, 2500=0,00259, 5000=0,00214 (USD); Case/Package: 0402; Number of Pins: 2; Case Code (Metric): 1005; Case Code (Imperial): 0402; Size Code: 0402; Min Operating Temperature: -55°C; Max Operating Temperature: 155°C; Tolerance: 1%; Package Quantity: 1; Packaging: Tape and Reel; Resistor Type: Thick Film; Number of Terminations: 2; Termination: SMD/SMT; Voltage Rating (DC): 50V; Features: Moisture Resistant; Series: RC; Technology: THICK FILM; Resistance Tolerance: 1%; Construction: Rectangular; Length: 1mm; Width: 0.02inch; Height: 0.016inch; Depth: 0.5mm; REACH SVHC: No SVHC; Military Standard: Not; Lead Free: Lead Free; RoHS Compliant: Yes; ComponentLink1URL: https://datasheet.ciiva.com/11808/0900766b80c66297-11808454.pdf?src-supplier=RSComponents; ComponentLink1Description: https://datasheet.ciiva.com/11808/0900766b80c66297-11808454.pdf?src-supplier=RSComponents; ComponentLink2URL: https://datasheet.ciiva.com/2453/pyu-r-int-thick-7-2453493.pdf?src-supplier=Digi-Key; ComponentLink2Description: https://datasheet.ciiva.com/2453/pyu-r-int-thick-7-2453493.pdf?src-supplier=Digi-Key; ComponentLink3URL: https://datasheet.ciiva.com/2453/pyu-r-int-thick-7-2453494.pdf?src-supplier=Digi-Key; ComponentLink3Description: https://datasheet.ciiva.com/2453/pyu-r-int-thick-7-2453494.pdf?src-supplier=Digi-Key; ComponentLink4URL: https://datasheet.ciiva.com/2453/pyu-r-int-thick-7-2453495.pdf?src-supplier=Digi-Key; ComponentLink4Description: https://datasheet.ciiva.com/2453/pyu-r-int-thick-7-2453495.pdf?src-supplier=Digi-Key; ComponentLink5URL: https://datasheet.ciiva.com/7983/1018594-7983511.pdf?src-supplier=Element14; ComponentLink5Description: https://datasheet.ciiva.com/7983/1018594-7983511.pdf?src-supplier=Element14; ComponentLink6URL: https://datasheet.ciiva.com/12558/pyu-rc0402-51-rohs-l-6-r-8721-12558796.pdf?src-supplier=Mouser; ComponentLink6Description: https://datasheet.ciiva.com/12558/pyu-rc0402-51-rohs-l-6-r-8721-12558796.pdf?src-supplier=Mouser; ComponentLink7URL: https://datasheet.ciiva.com/46394/1018594-46394974.pdf?src-supplier=Element14; ComponentLink7Description: https://datasheet.ciiva.com/46394/1018594-46394974.pdf?src-supplier=Element14